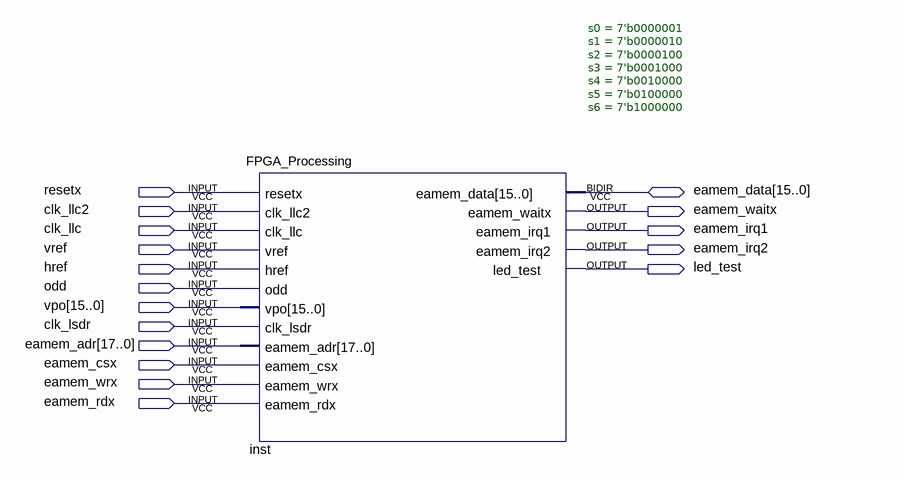
[diagram p0: schematic sheet]
// Quartus schematic SoCRobot_FPGA.bdf as structural Verilog: 1 symbols, 17 pins
module SoCRobot_FPGA (
  input  resetx,
  input  clk_llc2,
  input  clk_llc,
  input  vref,
  input  href,
  input  odd,
  input  [15:0] vpo,
  input  clk_lsdr,
  input  [17:0] eamem_adr,
  input  eamem_csx,
  input  eamem_wrx,
  input  eamem_rdx,
  inout  [15:0] eamem_data,
  output eamem_waitx,
  output eamem_irq1,
  output eamem_irq2,
  output led_test
);

  FPGA_Processing #(.s0(7'b0000001), .s1(7'b0000010), .s2(7'b0000100), .s3(7'b0001000), .s4(7'b0010000), .s5(7'b0100000), .s6(7'b1000000)) inst (
    .resetx(resetx), .clk_llc2(clk_llc2), .clk_llc(clk_llc), .vref(vref), .href(href), .odd(odd), .vpo(vpo),
    .clk_lsdr(clk_lsdr), .eamem_adr(eamem_adr), .eamem_csx(eamem_csx), .eamem_wrx(eamem_wrx),
    .eamem_rdx(eamem_rdx), .eamem_waitx(eamem_waitx), .eamem_irq1(eamem_irq1), .eamem_irq2(eamem_irq2),
    .led_test(led_test), .eamem_data(eamem_data));
endmodule
